# Altium schematic sheet DE-120824_01.SchDoc: JalousieBoard
size A3; Author: eldar6776@hotmail.com; DrawnBy: Eldar Dedic; Organization: JUBERA d.o.o.; Address1: Braće Mulić 81; Address2: 71000 Sarajevo; Address3: Federacija BiH; Address4: Bosna i Hercegovina; DocumentNumber: DE-120824; Revision: 001; SheetNumber: 1; SheetTotal: 2
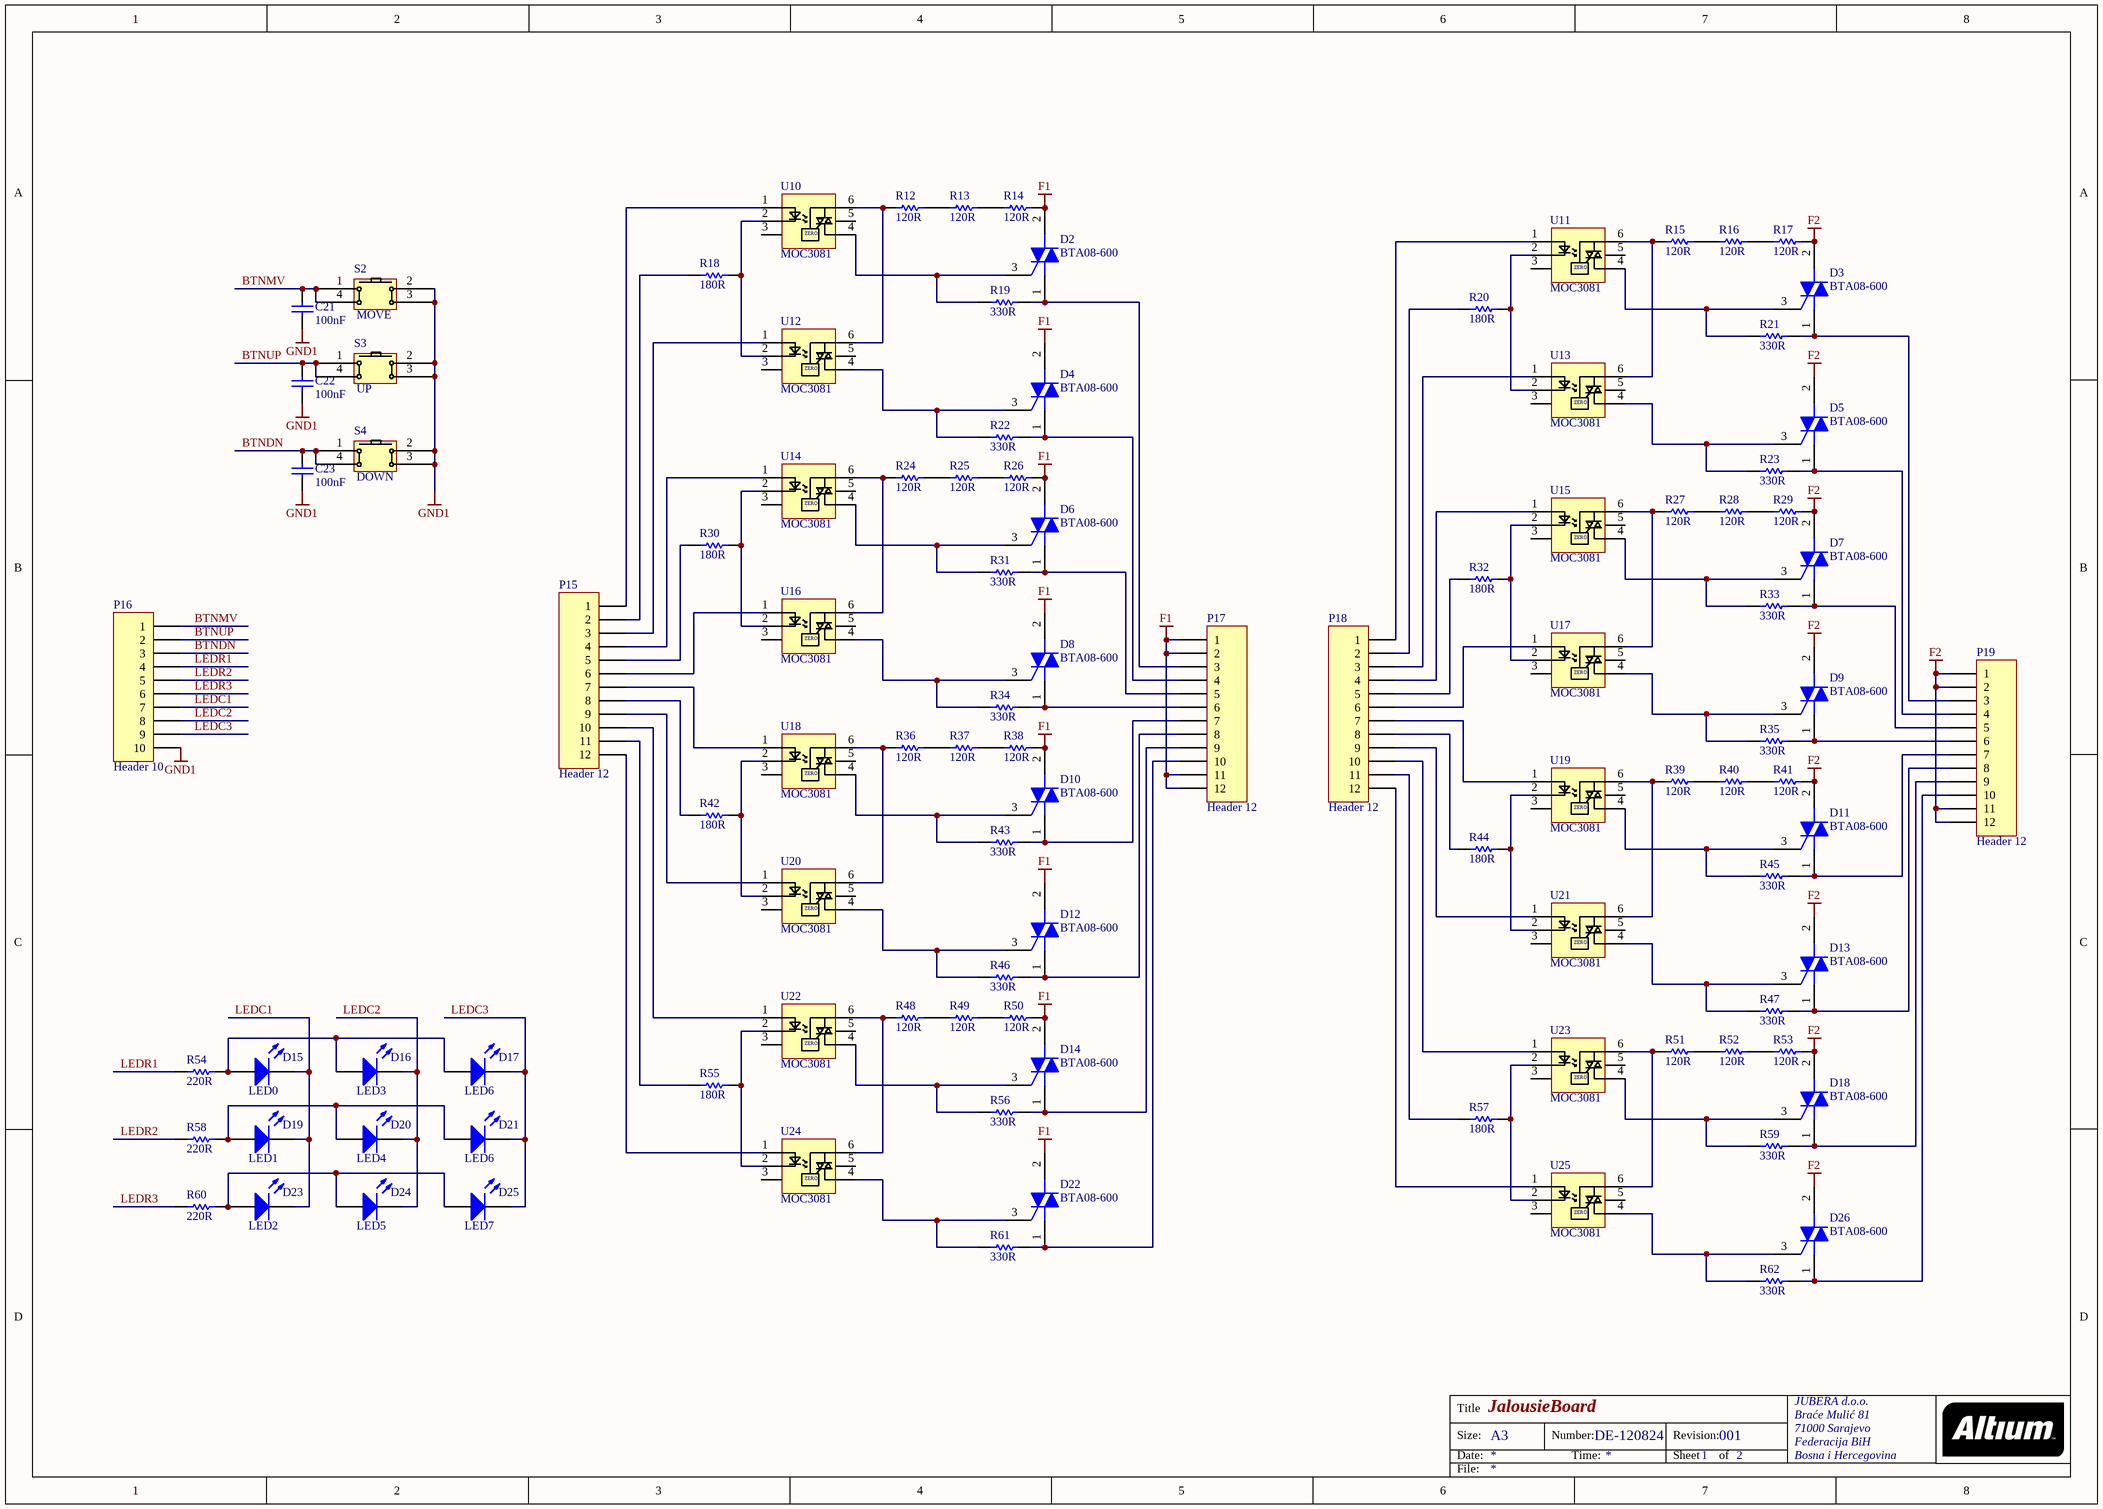
[diagram p0: DE-120824_01.SchDoc]

## Parts
C21  value 100nF  [0603]  (hidden comment: C0603)
C22  value 100nF  [0603]  (hidden comment: C0603)
C23  value 100nF  [0603]  (hidden comment: C0603)
D2  BTA08-600  [ONSC-TO-220-3-221A-07]
D3  BTA08-600  [ONSC-TO-220-3-221A-07]
D4  BTA08-600  [ONSC-TO-220-3-221A-07]
D5  BTA08-600  [ONSC-TO-220-3-221A-07]
D6  BTA08-600  [ONSC-TO-220-3-221A-07]
D7  BTA08-600  [ONSC-TO-220-3-221A-07]
D8  BTA08-600  [ONSC-TO-220-3-221A-07]
D9  BTA08-600  [ONSC-TO-220-3-221A-07]
D10  BTA08-600  [ONSC-TO-220-3-221A-07]
D11  BTA08-600  [ONSC-TO-220-3-221A-07]
D12  BTA08-600  [ONSC-TO-220-3-221A-07]
D13  BTA08-600  [ONSC-TO-220-3-221A-07]
D14  BTA08-600  [ONSC-TO-220-3-221A-07]
D15  LED0  [1.6X0.8X0.8]
D16  LED3  [1.6X0.8X0.8]
D17  LED6  [1.6X0.8X0.8]
D18  BTA08-600  [ONSC-TO-220-3-221A-07]
D19  LED1  [1.6X0.8X0.8]
D20  LED4  [1.6X0.8X0.8]
D21  LED6  [1.6X0.8X0.8]
D22  BTA08-600  [ONSC-TO-220-3-221A-07]
D23  LED2  [1.6X0.8X0.8]
D24  LED5  [1.6X0.8X0.8]
D25  LED7  [1.6X0.8X0.8]
D26  BTA08-600  [ONSC-TO-220-3-221A-07]
P15  Header 12  [HDR1X12]
P16  Header 10  [HDR1X10]
P17  Header 12  [HDR1X12]
P18  Header 12  [HDR1X12]
P19  Header 12  [HDR1X12]
R12  120R  [ERA-0805]
R13  120R  [ERA-0805]
R14  120R  [ERA-0805]
R15  120R  [ERA-0805]
R16  120R  [ERA-0805]
R17  120R  [ERA-0805]
R18  180R  [ERA-0603]
R19  330R  [ERA-0805]
R20  180R  [ERA-0603]
R21  330R  [ERA-0805]
R22  330R  [ERA-0805]
R23  330R  [ERA-0805]
R24  120R  [ERA-0805]
R25  120R  [ERA-0805]
R26  120R  [ERA-0805]
R27  120R  [ERA-0805]
R28  120R  [ERA-0805]
R29  120R  [ERA-0805]
R30  180R  [ERA-0603]
R31  330R  [ERA-0805]
R32  180R  [ERA-0603]
R33  330R  [ERA-0805]
R34  330R  [ERA-0805]
R35  330R  [ERA-0805]
R36  120R  [ERA-0805]
R37  120R  [ERA-0805]
R38  120R  [ERA-0805]
R39  120R  [ERA-0805]
R40  120R  [ERA-0805]
R41  120R  [ERA-0805]
R42  180R  [ERA-0603]
R43  330R  [ERA-0805]
R44  180R  [ERA-0603]
R45  330R  [ERA-0805]
R46  330R  [ERA-0805]
R47  330R  [ERA-0805]
R48  120R  [ERA-0805]
R49  120R  [ERA-0805]
R50  120R  [ERA-0805]
R51  120R  [ERA-0805]
R52  120R  [ERA-0805]
R53  120R  [ERA-0805]
R54  220R  [ERA-0805]
R55  180R  [ERA-0603]
R56  330R  [ERA-0805]
R57  180R  [ERA-0603]
R58  220R  [ERA-0805]
R59  330R  [ERA-0805]
R60  220R  [ERA-0805]
R61  330R  [ERA-0805]
R62  330R  [ERA-0805]
S2  MOVE  [TACTILE_SWITCH]
S3  UP  [TACTILE_SWITCH]
S4  DOWN  [TACTILE_SWITCH]
U10  MOC3081  [DIP6]
U11  MOC3081  [DIP6]
U12  MOC3081  [DIP6]
U13  MOC3081  [DIP6]
U14  MOC3081  [DIP6]
U15  MOC3081  [DIP6]
U16  MOC3081  [DIP6]
U17  MOC3081  [DIP6]
U18  MOC3081  [DIP6]
U19  MOC3081  [DIP6]
U20  MOC3081  [DIP6]
U21  MOC3081  [DIP6]
U22  MOC3081  [DIP6]
U23  MOC3081  [DIP6]
U24  MOC3081  [DIP6]
U25  MOC3081  [DIP6]

## Nets
F1: D2.2(MT2) D4.2(MT2) D6.2(MT2) D8.2(MT2) D10.2(MT2) D12.2(MT2) D14.2(MT2) D22.2(MT2) P17.1 P17.2 P17.11 P17.12 R14.2 R26.2 R38.2 R50.2
F2: D3.2(MT2) D5.2(MT2) D7.2(MT2) D9.2(MT2) D11.2(MT2) D13.2(MT2) D18.2(MT2) D26.2(MT2) P19.1 P19.2 P19.11 P19.12 R17.2 R29.2 R41.2 R53.2
GND1: C21.2 C22.2 C23.2 P16.10 S2.2 S2.3 S3.2 S3.3 S4.2 S4.3
BTNDN: C23.1 P16.3 S4.1 S4.4
BTNMV: C21.1 P16.1 S2.1 S2.4
BTNUP: C22.1 P16.2 S3.1 S3.4
LEDC1: D15.2(K) D19.2(K) D23.2(K) P16.7
LEDC2: D16.2(K) D20.2(K) D24.2(K) P16.8
LEDC3: D17.2(K) D21.2(K) D25.2(K) P16.9
LEDR1: P16.4 R54.1
LEDR2: P16.5 R58.1
LEDR3: P16.6 R60.1
NetD2_1: D2.1(MT1) P17.3 R19.2
NetD2_3: D2.3(G) R19.1 U10.4
NetD3_1: D3.1(MT1) P19.3 R21.2
NetD3_3: D3.3(G) R21.1 U11.4
NetD4_1: D4.1(MT1) P17.4 R22.2
NetD4_3: D4.3(G) R22.1 U12.4
NetD5_1: D5.1(MT1) P19.4 R23.2
NetD5_3: D5.3(G) R23.1 U13.4
NetD6_1: D6.1(MT1) P17.5 R31.2
NetD6_3: D6.3(G) R31.1 U14.4
NetD7_1: D7.1(MT1) P19.5 R33.2
NetD7_3: D7.3(G) R33.1 U15.4
NetD8_1: D8.1(MT1) P17.6 R34.2
NetD8_3: D8.3(G) R34.1 U16.4
NetD9_1: D9.1(MT1) P19.6 R35.2
NetD9_3: D9.3(G) R35.1 U17.4
NetD10_1: D10.1(MT1) P17.7 R43.2
NetD10_3: D10.3(G) R43.1 U18.4
NetD11_1: D11.1(MT1) P19.7 R45.2
NetD11_3: D11.3(G) R45.1 U19.4
NetD12_1: D12.1(MT1) P17.8 R46.2
NetD12_3: D12.3(G) R46.1 U20.4
NetD13_1: D13.1(MT1) P19.8 R47.2
NetD13_3: D13.3(G) R47.1 U21.4
NetD14_1: D14.1(MT1) P17.9 R56.2
NetD14_3: D14.3(G) R56.1 U22.4
NetD15_1: D15.1(A) D16.1(A) D17.1(A) R54.2
NetD18_1: D18.1(MT1) P19.9 R59.2
NetD18_3: D18.3(G) R59.1 U23.4
NetD19_1: D19.1(A) D20.1(A) D21.1(A) R58.2
NetD22_1: D22.1(MT1) P17.10 R61.2
NetD22_3: D22.3(G) R61.1 U24.4
NetD23_1: D23.1(A) D24.1(A) D25.1(A) R60.2
NetD26_1: D26.1(MT1) P19.10 R62.2
NetD26_3: D26.3(G) R62.1 U25.4
NetP15_1: P15.1 U10.1
NetP15_2: P15.2 R18.1
NetP15_3: P15.3 U12.1
NetP15_4: P15.4 U14.1
NetP15_5: P15.5 R30.1
NetP15_6: P15.6 U16.1
NetP15_7: P15.7 U18.1
NetP15_8: P15.8 R42.1
NetP15_9: P15.9 U20.1
NetP15_10: P15.10 U22.1
NetP15_11: P15.11 R55.1
NetP15_12: P15.12 U24.1
NetP18_1: P18.1 U11.1
NetP18_2: P18.2 R20.1
NetP18_3: P18.3 U13.1
NetP18_4: P18.4 U15.1
NetP18_5: P18.5 R32.1
NetP18_6: P18.6 U17.1
NetP18_7: P18.7 U19.1
NetP18_8: P18.8 R44.1
NetP18_9: P18.9 U21.1
NetP18_10: P18.10 U23.1
NetP18_11: P18.11 R57.1
NetP18_12: P18.12 U25.1
NetR12_1: R12.1 U10.6 U12.6
NetR12_2: R12.2 R13.1
NetR13_2: R13.2 R14.1
NetR15_1: R15.1 U11.6 U13.6
NetR15_2: R15.2 R16.1
NetR16_2: R16.2 R17.1
NetR18_2: R18.2 U10.2 U12.2
NetR20_2: R20.2 U11.2 U13.2
NetR24_1: R24.1 U14.6 U16.6
NetR24_2: R24.2 R25.1
NetR25_2: R25.2 R26.1
NetR27_1: R27.1 U15.6 U17.6
NetR27_2: R27.2 R28.1
NetR28_2: R28.2 R29.1
NetR30_2: R30.2 U14.2 U16.2
NetR32_2: R32.2 U15.2 U17.2
NetR36_1: R36.1 U18.6 U20.6
NetR36_2: R36.2 R37.1
NetR37_2: R37.2 R38.1
NetR39_1: R39.1 U19.6 U21.6
NetR39_2: R39.2 R40.1
NetR40_2: R40.2 R41.1
NetR42_2: R42.2 U18.2 U20.2
NetR44_2: R44.2 U19.2 U21.2
NetR48_1: R48.1 U22.6 U24.6
NetR48_2: R48.2 R49.1
NetR49_2: R49.2 R50.1
NetR51_1: R51.1 U23.6 U25.6
NetR51_2: R51.2 R52.1
NetR52_2: R52.2 R53.1
NetR55_2: R55.2 U22.2 U24.2
NetR57_2: R57.2 U23.2 U25.2

Not connected (* = marked no-connect by the designer): U10 3 5; U11 3 5; U12 3 5; U13 3 5; U14 3 5; U15 3 5; U16 3 5; U17 3 5; U18 3 5; U19 3 5; U20 3 5; U21 3 5; U22 3 5; U23 3 5; U24 3 5; U25 3 5

## Notes on the sheet
- Title
- Size:
- Date:
- A3
- Number:
- Time:
- Revision:
- Sheet
- of
- File:
- (in symbol MOC3081) ZERO

## Library data of the parts
C21-C23 = C0603: Ceramic Chip Capacitor - Standard; Note: Footprint corresponds to dimensions for bulk cassette packaging. This case size has tightened tolerances.; Published: 17-Jul-2002; LatestRevisionDate: 19-Mar-2004; LatestRevisionNote: Silkscreen size reduced.; DatasheetDocument: Mar-2001; PackageDocument: Mar-2001; PackageReference: 0603; Publisher: Altium Limited; Code_JEITA: 0603; Code_IPC: 1608 [0603]; ComponentLink1Description: Manufacturer Link; ComponentLink1URL: http://www.kemet.com/; ComponentLink2Description: Datasheet; ComponentLink2URL: http://www.kemet.com/kemet/web/homepage/kechome.nsf/vapubfilesname/F3102TA.pdf/$file/F3102TA.pdf
D2-D14 D18 D22 D26 = BTA08-600BW3G: Triacs, Silicon Bidirectional Thyristor, 3-Pin TO-220, Pb-Free, Tube; Manufacturer: On Semiconductor; IGT Max (mA): 50; IT(RMS) Max (A): 8; ITSM Max (A): 90; DatasheetVersion: Rev. 1; PackageVersion: Rev. O, 07/2008; PackageReference: TO-220-3-221A-07; PackageDescription: 3-Pin Flange Mount, Vertical Straight Lead, Body 9.97 x 4.445 mm, Pitch 2.54 mm; Supplier 1: Digi-Key; Supplier Part Number 1: BTA08-600BW3G-ND; Supplier 2: Newark; Supplier Part Number 2: 13P2072; Supplier 3: Mouser; Supplier Part Number 3: 863-BTA08-600BW3G; Packing: Tube; RoHS: Pb-Free; Mounting Technology: Through Hole; PartNumber: BTA08-600BW3G; ComponentLink1Description: Manufacturer URL; ComponentLink1URL: http://www.onsemi.com/; ComponentLink2Description: Datasheet; ComponentLink2URL: http://www.onsemi.com/pub_link/Collateral/BTA08-600BW3-D.PDF; ComponentLink3Description: Package Specification; ComponentLink3URL: http://www.onsemi.com/pub_link/Collateral/221A-07.PDF
D15-D17 D19-D21 D23-D25 = HSMB-C190: Blue Surface Mount Chip LED, Blue; LuminousIntensity: 1.6mcd (Minimum).; PCB_Layout: Complies with manufacturer's recommendation.; Published: 11-Dec-2002; DatasheetVersion: 26-Feb-2002; PackageVersion: Mar-2002; PackageReference: 1.6X0.8X0.8; Publisher: Altium Limited; PackageDescription: SM LED; 2 Flat Leads; LED_Colour: Blue; ComponentLink1Description: Manufacturer Link; ComponentLink1URL: http://www.avagotech.com/; ComponentLink2Description: Datasheet; ComponentLink2URL: http://cp.literature.agilent.com/litweb/pdf/5988-5211EN.pdf
P15 P17-P19 = Header 12: Header, 12-Pin; LatestRevisionDate: 17-Jul-2002; LatestRevisionNote: Re-released for DXP Platform.; Publisher: Altium Limited
P16 = Header 10: Header, 10-Pin; LatestRevisionDate: 17-Jul-2002; LatestRevisionNote: Re-released for DXP Platform.; Publisher: Altium Limited
R12-R17 R19 R21-R29 R31 R33-R41 R43 R45-R54 R56 R58-R62 = ERAS: Metal Film Thermosensitive Chip Resistor, 0.56 Ohm to 10k Ohm Range, 5% Tolerance, 0805 Size, 0.1 W; Note: If flow soldering, adjust pad width of PCB Footprint to 0.7 - 0.8 times the width of the resistor.; Published: 17-Dec-2003; LatestRevisionDate: 19-Mar-2004; LatestRevisionNote: Silkscreen size reduced.; PackageDocument: Mar-2003; PackageReference: ERA-0805; Publisher: Altium Limited; Code_IPC: 2012 [0805]; ComponentLink1Description: Manufacturer Link; ComponentLink1URL: http://www.panasonic.com/industrial/components/resistive_products.htm; ComponentLink2Description: Datasheet; ComponentLink2URL: http://www.panasonic.com/industrial/components/pdf/AOF0000CE1.pdf
R18 R20 R30 R32 R42 R44 R55 R57 = ERA3Y: Rectangular Thick Film Chip Resistor, 10 Ohm to 330k Ohm Range, 0.1% and 0.5% Tolerance, 0603 Size, 0.063 W; Note: If flow soldering, adjust pad width of PCB Footprint to 0.7 - 0.8 times the width of the resistor.; Published: 17-Dec-2003; LatestRevisionDate: 19-Mar-2004; LatestRevisionNote: Silkscreen size reduced.; PackageDocument: Mar-2003; PackageReference: ERA-0603; Publisher: Altium Limited; Code_IPC: 1608 [0603]; ComponentLink1Description: Manufacturer Link; ComponentLink1URL: http://www.panasonic.com/industrial/components/resistive_products.htm; ComponentLink2Description: Datasheet; ComponentLink2URL: http://www.panasonic.com/industrial/components/pdf/AOA0000CE8.pdf
S2-S4 = TACKTILE_SWITCH
U10-U25 = MOC3081: Zero-Cross Optoisolator Triac Driver